# Altium schematic sheet MCU_RF.SchDoc
size B
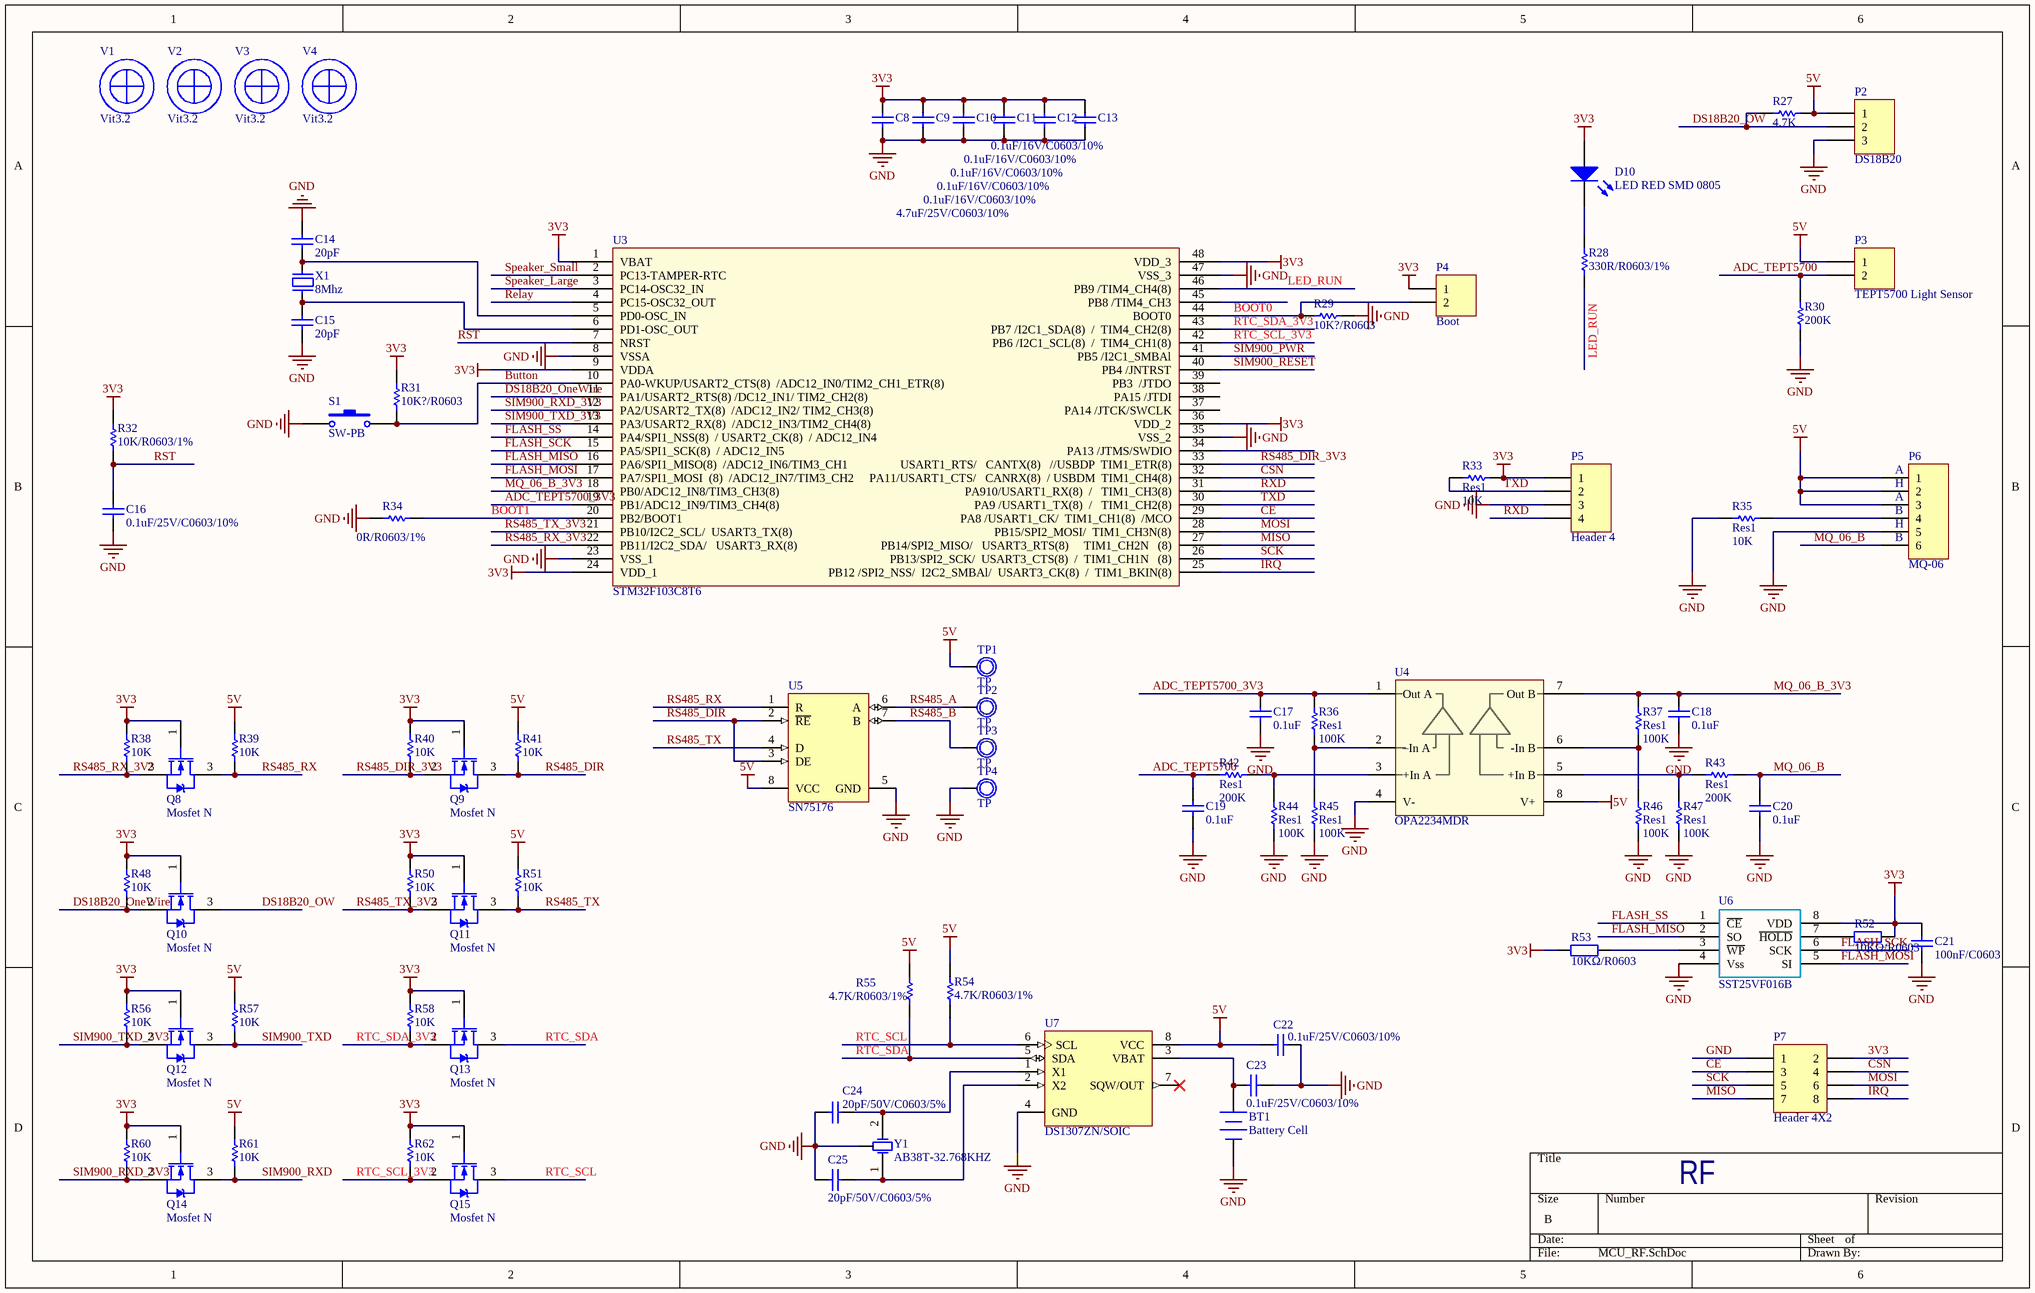
[diagram p0: MCU_RF.SchDoc]

## Parts
BT1  Battery Cell  [Battery CELL_HOLDER]
C8  4.7uF/25V/C0603/10%  [C0603]
C9  0.1uF/16V/C0603/10%  [C0603]
C10  0.1uF/16V/C0603/10%  [C0603]
C11  0.1uF/16V/C0603/10%  [C0603]
C12  0.1uF/16V/C0603/10%  [C0603]
C13  0.1uF/16V/C0603/10%  [C0603]
C14  20pF  [C0603]
C15  20pF  [C0603]
C16  0.1uF/25V/C0603/10%  [C0603]
C17  0.1uF  [C0603]
C18  0.1uF  [C0603]
C19  0.1uF  [C0603]
C20  0.1uF  [C0603]
C21  100nF/C0603  [c0603]
C22  0.1uF/25V/C0603/10%  [C0603]
C23  0.1uF/25V/C0603/10%  [C0603]
C24  20pF/50V/C0603/5%  [C0603]
C25  20pF/50V/C0603/5%  [C0603]
D10  LED RED SMD 0805  [led0805]
P2  DS18B20  [HDR1X3]
P3  TEPT5700 Light Sensor  [LED-5-BLUE]
P4  Boot  [HDR1X2]
P5  Header 4  [HDR1X4]
P6  MQ-06  [MQ-02]
P7  Header 4X2  [HDR2X4]
Q8  Mosfet N  [SOT 23]
Q9  Mosfet N  [SOT 23]
Q10  Mosfet N  [SOT 23]
Q11  Mosfet N  [SOT 23]
Q12  Mosfet N  [SOT 23]
Q13  Mosfet N  [SOT 23]
Q14  Mosfet N  [SOT 23]
Q15  Mosfet N  [SOT 23]
R27  value 4.7K  [SM-RES-0805]  (hidden comment: Res1)
R28  330R/R0603/1%  [R0603]
R29  10K?/R0603  [R0603]
R30  value 200K  [SM-RES-0805]  (hidden comment: Res1)
R31  10K?/R0603  [R0603]
R32  10K/R0603/1%  [R0603]
R33  Res1  value 10K  [R0603]
R34  0R/R0603/1%  [R0603]
R35  Res1  value 10K  [SM-RES-0805]
R36  Res1  value 100K  [R0603]
R37  Res1  value 100K  [R0603]
R38  10K  [R0603]
R39  10K  [R0603]
R40  10K  [R0603]
R41  10K  [R0603]
R42  Res1  value 200K  [R0603]
R43  Res1  value 200K  [R0603]
R44  Res1  value 100K  [R0603]
R45  Res1  value 100K  [R0603]
R46  Res1  value 100K  [R0603]
R47  Res1  value 100K  [R0603]
R48  10K  [R0603]
R50  10K  [R0603]
R51  10K  [R0603]
R52  10KΩ/R0603  [r0603]
R53  10KΩ/R0603  [r0603]
R54  4.7K/R0603/1%  [R0603]
R55  4.7K/R0603/1%  [R0603]
R56  10K  [R0603]
R57  10K  [R0603]
R58  10K  [R0603]
R60  10K  [R0603]
R61  10K  [R0603]
R62  10K  [R0603]
S1  SW-PB  [Button-2pin]
TP1  TP  [TP1]
TP2  TP  [TP1]
TP3  TP  [TP1]
TP4  TP  [TP1]
U3  STM32F103C8T6  [ST_TSQFP50P910X910X160-48N]
U4  OPA2234MDR  [SOP 8Pin]
U5  SN75176  [SOP127P600X175-8N]
U6  SST25VF016B  [SOIC8]
U7  DS1307ZN/SOIC  [SOIC-8]
V1  Vit3.2  [Vit3.2]
V2  Vit3.2  [Vit3.2]
V3  Vit3.2  [Vit3.2]
V4  Vit3.2  [Vit3.2]
X1  8Mhz  [XT2]
Y1  AB38T-32.768KHZ  [ZTA - 38k]

## Nets
3V3: C8.2 C9.2 C10.2 C11.2 C12.2 C13.2 C21.2 D10.1(A) P4.1 P5.1 P7.2 Q8.1(G) Q9.1(G) Q10.1(G) Q11.1(G) Q12.1(G) Q13.1(G) Q14.1(G) Q15.1(G) R31.1 R32.2 R33.2 R38.1 R40.1 R48.1 R50.1 R52.2 R53.1 R56.1 R58.1 R60.1 R62.1 U3.1(VBAT) U3.9(VDDA) U3.24(VDD_1) U3.36(VDD_2) U3.48(VDD_3) U6.8(VDD)
5V: C22.2 P2.1 P3.1 P6.1 P6.2 P6.3 R27.1 R39.1 R41.1 R51.1 R54.2 R55.2 R57.1 R61.1 TP1.1 U4.8(V+) U5.8(VCC) U7.8(VCC)
GND: BT1.2(-) C8.1 C9.1 C10.1 C11.1 C12.1 C13.1 C14.2 C15.1 C16.1 C17.2 C18.2 C19.2 C20.2 C21.1 C22.1 C23.1 C24.1 C25.1 P2.3 P5.3 P6.5 P7.1 R29.1 R30.1 R34.1 R35.1 R44.1 R45.1 R46.1 R47.1 S1.1 TP4.1 U3.8(VSSA) U3.23(VSS_1) U3.35(VSS_2) U3.47(VSS_3) U4.4(V-) U5.5(GND) U6.4(Vss) U7.4(GND) Y1.3(GND)
ADC_TEPT5700: C19.1 P3.2 R30.2 R42.1
ADC_TEPT5700_3V3: C17.1 R36.2 U3.19(PB1/ADC12_IN9/TIM3_CH4(8)) U4.1(Out_A)
BOOT0: P4.2 R29.2 U3.44(BOOT0)
BOOT1: R34.2 U3.20(PB2/BOOT1)
Button: R31.2 S1.2 U3.10(PA0-WKUP/USART2_CTS(8)__/ADC12_IN0/TIM2_CH1_ETR(8))
CE: P7.3 U3.29(PA8_/USART1_CK/__TIM1_CH1(8)__/MCO)
CSN: P7.4 U3.32(PA11/USART1_CTS/___CANRX(8)__/_USBDM__TIM1_CH4(8))
DS18B20_OneWire: Q10.2(S) R48.2 U3.11(PA1/USART2_RTS(8)_/DC12_IN1/_TIM2_CH2(8))
DS18B20_OW: P2.2 Q10.3(D) R27.2
FLASH_MISO: U3.16(PA6/SPI1_MISO(8)__/ADC12_IN6/TIM3_CH1) U6.2(SO)
FLASH_MOSI: U3.17(PA7/SPI1_MOSI__(8)__/ADC12_IN7/TIM3_CH2) U6.5(SI)
FLASH_SCK: U3.15(PA5/SPI1_SCK(8)__/_ADC12_IN5) U6.6(SCK)
FLASH_SS: U3.14(PA4/SPI1_NSS(8)__/_USART2_CK(8)__/_ADC12_IN4) U6.1(~{CE})
IRQ: P7.8 U3.25(PB12_/SPI2_NSS/__I2C2_SMBAl/__USART3_CK(8)__/__TIM1_BKIN(8))
LED_RUN: R28.2 U3.46(PB9_/TIM4_CH4(8))
MISO: P7.7 U3.27(PB14/SPI2_MISO/___USART3_RTS(8)_____TIM1_CH2N___(8))
MOSI: P7.6 U3.28(PB15/SPI2_MOSI/__TIM1_CH3N(8))
MQ_06_B: C20.1 P6.6 R43.2
MQ_06_B_3V3: C18.1 R37.2 U3.18(PB0/ADC12_IN8/TIM3_CH3(8)) U4.7(Out_B)
Relay: U3.4(PC15-OSC32_OUT)
RS485_A: TP2.1 U5.6(A)
RS485_B: TP3.1 U5.7(B)
RS485_DIR: Q9.3(D) R41.2 U5.2(~{RE}) U5.3(DE)
RS485_DIR_3V3: Q9.2(S) R40.2 U3.33(USART1_RTS/___CANTX(8)___//USBDP__TIM1_ETR(8))
RS485_RX: Q8.3(D) R39.2 U5.1(R)
RS485_RX_3V3: Q8.2(S) R38.2 U3.22(PB11/I2C2_SDA/___USART3_RX(8))
RS485_TX: Q11.3(D) R51.2 U5.4(D)
RS485_TX_3V3: Q11.2(S) R50.2 U3.21(PB10/I2C2_SCL/__USART3_TX(8))
RST: C16.2 R32.1 U3.7(NRST)
RTC_SCL: Q15.3(D) R54.1 U7.6(SCL)
RTC_SCL_3V3: Q15.2(S) R62.2 U3.42(PB6_/I2C1_SCL(8)__/__TIM4_CH1(8))
RTC_SDA: Q13.3(D) R55.1 U7.5(SDA)
RTC_SDA_3V3: Q13.2(S) R58.2 U3.43(PB7_/I2C1_SDA(8)__/__TIM4_CH2(8))
RXD: P5.4 U3.31(PA910/USART1_RX(8)__/___TIM1_CH3(8))
SCK: P7.5 U3.26(PB13/SPI2_SCK/__USART3_CTS(8)__/__TIM1_CH1N___(8))
SIM900_PWR: U3.41(PB5_/I2C1_SMBAl)
SIM900_RESET: U3.40(PB4_/JNTRST)
SIM900_RXD: Q14.3(D) R61.2
SIM900_RXD_3V3: Q14.2(S) R60.2 U3.12(PA2/USART2_TX(8)__/ADC12_IN2/_TIM2_CH3(8))
SIM900_TXD: Q12.3(D) R57.2
SIM900_TXD_3V3: Q12.2(S) R56.2 U3.13(PA3/USART2_RX(8)__/ADC12_IN3/TIM2_CH4(8))
Speaker_Large: U3.3(PC14-OSC32_IN)
Speaker_Small: U3.2(PC13-TAMPER-RTC)
TXD: P5.2 R33.1 U3.30(PA9_/USART1_TX(8)__/___TIM1_CH2(8))
NetBT1_1: BT1.1(+) C23.2 U7.3(VBAT)
NetC14_1: C14.1 U3.5(PD0-OSC_IN) X1.2
NetC15_2: C15.2 U3.6(PD1-OSC_OUT) X1.1
NetC24_2: C24.2 U7.1(X1) Y1.2(OSC2)
NetC25_2: C25.2 U7.2(X2) Y1.1(OSC1)
NetD10_2: D10.2(K) R28.1
NetP6_4: P6.4 R35.2
NetR36_1: R36.1 R45.2 U4.2(–In_A)
NetR37_1: R37.1 R46.2 U4.6(-In_B)
NetR42_2: R42.2 R44.2 U4.3(+In_A)
NetR43_1: R43.1 R47.2 U4.5(+In_B)
NetR52_1: R52.1 U6.7(~{HOLD})
NetR53_2: R53.2 U6.3(~{WP})

Not connected (* = marked no-connect by the designer): U3 34(PA13_/JTMS/SWDIO) 37(PA14_/JTCK/SWCLK) 38(PA15_/JTDI) 39(PB3__/JTDO) 45(PB8_/TIM4_CH3); U7 7(SQW/OUT)*

## Notes on the sheet
- (near P6) A
- (near P6) H
- (near P6) B
- RF

## Library data of the parts
BT1 = Battery Holder Cell 20mm: HOLDER COINCELL 2032 RETAINRCLIP; Manufacturer: MPD (Memory Protection Devices); Manufacturer Part Number: BS-7; Battery Type, Function: Coin Cell, Holder; Style: Holder (Open); Battery Cell Size: Coin, 20.0mm; Number of Cells: 1; Battery Series: 2032; Supplier 1: Digi-Key; RoHS: RoHS Compliant; Category: Battery Products; Stock 1: 37883; Pricing 1: 1=0.77, 10=0.71, 100=0.64, 500=0.58, 1000=0.46 (USD); Mounting Type: PCB, Through Hole; Termination Style: PC Pin; Height Above Board: 0.354" (9.00mm); Operating Temperature: -55°C ~ 105°C; ComponentLink1URL: http://www.memoryprotectiondevices.com/datasheets/BS-7-datasheet.pdf; ComponentLink1Description: http://www.memoryprotectiondevices.com/datasheets/BS-7-datasheet.pdf; Supplier Part Number 1: BS-7-ND
C8 = 4.7uF/25V/C0603/10%: CAP CER 4.7UF 25V 10% X6S 0603; Manufacturer: Murata Electronics North America; Manufacturer Part Number: GRM188C81E475KE11D; Capacitance: 4.7µF; Supplier 1: Digi-Key; RoHS: RoHS Compliant; Category: Capacitors; Stock 1: 57548; Pricing 1: 1=0.42, 10=0.368, 50=0.2236, 100=0.1841, 250=0.14728, 500=0.13414, 1000=0.12098 (USD); Packaging: Digi-Reel®; Tolerance: ±10%; Voltage - Rated: 25V; Temperature Coefficient: X6S; Mounting Type: Surface Mount, MLCC; Operating Temperature: -55°C ~ 105°C; Applications: General Purpose; Ratings: -; Package / Case: 0603 (1608 Metric); Size / Dimension: 0.063" L x 0.031" W (1.60mm x 0.80mm); Height - Seated (Max): -; Thickness (Max): 0.039" (1.00mm); Lead Spacing: -; Features: -; Lead Style: -; ComponentLink1URL: http://www.murata.com/~/media/webrenewal/support/library/catalog/products/capacitor/mlcc/c02e.ashx; ComponentLink1Description: http://www.murata.com/~/media/webrenewal/support/library/catalog/products/capacitor/mlcc/c02e.ashx
C9-C13 = 0.1uF/16V/C0603/10%: CAP CER 0.1UF 16V 10% X7R 0603; Manufacturer: Kemet; Manufacturer Part Number: C0603C104K4RACTU; Capacitance: 0.1µF; Supplier 1: Digi-Key; RoHS: RoHS Compliant; Category: Capacitors; Stock 1: 2315544; Pricing 1: 1=0.1, 10=0.022, 25=0.0156, 50=0.012, 100=0.0101, 250=0.00828, 1000=0.0054 (USD); Packaging: Cut Tape (CT); Tolerance: ±10%; Voltage - Rated: 16V; Temperature Coefficient: X7R; Mounting Type: Surface Mount, MLCC; Operating Temperature: -55°C ~ 125°C; Applications: General Purpose; Ratings: -; Package / Case: 0603 (1608 Metric); Size / Dimension: 0.063" L x 0.031" W (1.60mm x 0.80mm); Height - Seated (Max): -; Thickness (Max): 0.034" (0.87mm); Lead Spacing: -; Features: -; Lead Style: -; ComponentLink1URL: http://www.kemet.com/docfinder?Partnumber=C0603C104K4RACTU; ComponentLink1Description: http://www.kemet.com/docfinder?Partnumber=C0603C104K4RACTU; Supplier Part Number 1: 399-1096-1-ND
C14 C15 = Cap: Capacitor; Ordering: 10pF/C0603/6.3V; Muf: Murata/Japan; Des: Ceramic Cap; Property: Cap; Price: *
C16-C20 C22 C23 = 0.1uF/25V/C0603/10%: CAP CER 0.1UF 25V 10% X7R 0603; Manufacturer: Murata Electronics North America; Manufacturer Part Number: GRM188R71E104KA01D; Capacitance: 0.1µF; Supplier 1: Digi-Key; RoHS: RoHS Compliant; Category: Capacitors; Stock 1: 8148157; Pricing 1: 1=0.1, 10=0.019, 50=0.0104, 100=0.0088, 250=0.0072, 500=0.00616, 1000=0.0048 (USD); Packaging: Cut Tape (CT); Tolerance: ±10%; Voltage - Rated: 25V; Temperature Coefficient: X7R; Mounting Type: Surface Mount, MLCC; Operating Temperature: -55°C ~ 125°C; Applications: General Purpose; Ratings: -; Package / Case: 0603 (1608 Metric); Size / Dimension: 0.063" L x 0.031" W (1.60mm x 0.80mm); Height - Seated (Max): -; Thickness (Max): 0.035" (0.90mm); Lead Spacing: -; Features: -; Lead Style: -; ComponentLink1URL: http://www.murata.com/~/media/webrenewal/support/library/catalog/products/capacitor/mlcc/c02e.ashx; ComponentLink1Description: http://www.murata.com/~/media/webrenewal/support/library/catalog/products/capacitor/mlcc/c02e.ashx
C21 = Cap: Capacitor; Published: 8-Jun-2000; LatestRevisionDate: 17-Jul-2002; LatestRevisionNote: Re-released for DXP Platform.; PackageReference: RAD-0.3; Publisher: Altium Limited; Value: 100nF/C0603
C24 C25 = 20pF/50V/C0603/5%: CAP CER 20PF 50V 5% NP0 0603; Manufacturer: Samsung Electro-Mechanics America, Inc.; Manufacturer Part Number: CL10C200JB8NNNC; Temperature Coefficient: C0G, NP0; Supplier 1: Digi-Key; RoHS: RoHS Compliant; Category: Capacitors; Stock 1: 129313; Pricing 1: 1=0.1, 10=0.031, 25=0.0216, 100=0.0141, 500=0.00986, 1000=0.00768 (USD); Packaging: Cut Tape (CT); Capacitance: 20pF; Tolerance: ±5%; Voltage - Rated: 50V; Mounting Type: Surface Mount, MLCC; Operating Temperature: -55°C ~ 125°C; Applications: General Purpose; Ratings: -; Package / Case: 0603 (1608 Metric); Size / Dimension: 0.063" L x 0.031" W (1.60mm x 0.80mm); Height - Seated (Max): -; Thickness (Max): 0.035" (0.90mm); Lead Spacing: -; Features: -; Lead Style: -; ComponentLink1URL: http://www.samsungsem.com/kr/support/product-search/mlcc/CL10C200JB8NNNC.jsp; ComponentLink1Description: http://www.samsungsem.com/kr/support/product-search/mlcc/CL10C200JB8NNNC.jsp
D10 = LED RED SMD 0805: LED RED DIFFUSED 0805 SMD; Manufacturer: OSRAM Opto Semiconductors Inc.; Manufacturer Part Number: LH R974-LP-1; Wavelength - Dominant: 645nm; Wavelength - Peak: 660nm; Millicandela Rating: 41mcd; Voltage - Forward (Vf) (Typ): 1.8V; Current - Test: 20mA; Viewing Angle: 160°; Lens Color: White; Lens Style/Size: Rectangle with Flat Top, 1.30mm x 1.25mm; Supplier 1: Digi-Key; RoHS: RoHS Compliant; Category: Optoelectronics; Stock 1: 72062; Pricing 1: 1=0.26, 10=0.207, 25=0.1792, 100=0.1131, 250=0.0754, 500=0.06408, 1000=0.049 (USD); Packaging: Cut Tape (CT); Color: Red; Lens Transparency: Diffused; Package / Case: 0805 (2012 Metric); Supplier Device Package: *; Size / Dimension: 2.00mm L x 1.25mm W; Height (Max): 0.90mm; Mounting Type: Surface Mount; ComponentLink1URL: http://www.osram-os.com/Graphics/XPic8/00078869_0.pdf; ComponentLink1Description: http://www.osram-os.com/Graphics/XPic8/00078869_0.pdf
P2 = Header 3: Header, 3-Pin; LatestRevisionDate: 17-Jul-2002; LatestRevisionNote: Re-released for DXP Platform.; Publisher: Altium Limited
P3 P4 = Header 2: Header, 2-Pin; LatestRevisionDate: 17-Jul-2002; LatestRevisionNote: Re-released for DXP Platform.; Publisher: Altium Limited
P5 = Header 4: Header, 4-Pin; LatestRevisionDate: 17-Jul-2002; LatestRevisionNote: Re-released for DXP Platform.; Publisher: Altium Limited
P6 = Header 6: Header, 6-Pin; LatestRevisionDate: 17-Jul-2002; LatestRevisionNote: Re-released for DXP Platform.; Publisher: Altium Limited
P7 = Header 4X2: Header, 4-Pin, Dual row; LatestRevisionDate: 17-Jul-2002; LatestRevisionNote: Re-released for DXP Platform.; Publisher: Altium Limited
R27 R30 R33 R35-R37 R42-R47 = Res1: Resistor; Published: 8-Jun-2000; LatestRevisionDate: 17-Jul-2002; LatestRevisionNote: Re-released for DXP Platform.; PackageReference: AXIAL-0.3; Publisher: Altium Limited; PackageDescription: Axial Device, Thru-Hole; 2 Leads; 0.3 in Pin Spacing
R28 = 330R/R0603/1%: RES SMD 330 OHM 1% 1/10W 0603; Manufacturer: Yageo; Manufacturer Part Number: RC0603FR-07330RL; Resistance (Ohms): 330; Power (Watts): 0.1W, 1/10W; Temperature Coefficient: ±100ppm/°C; Supplier 1: Digi-Key; RoHS: RoHS Compliant; Category: Resistors; Stock 1: 464448; Pricing 1: 1=0.1, 10=0.014, 25=0.01, 100=0.0057, 250=0.00436, 500=0.00348, 1000=0.00257, 2500=0.00223 (USD); Packaging: Cut Tape (CT); Tolerance: ±1%; Composition: Thick Film; Features: Moisture Resistant; Operating Temperature: -55°C ~ 155°C; Package / Case: 0603 (1608 Metric); Supplier Device Package: 0603; Size / Dimension: 0.063" L x 0.031" W (1.60mm x 0.80mm); Height: 0.022" (0.55mm); Number of Terminations: 2; ComponentLink1URL: http://www.yageo.com/NewPortal/yageodocoutput?fileName=/pdf/R-Chip/PYu-RC_Group_51_RoHS_L_3.pdf; ComponentLink1Description: http://www.yageo.com/NewPortal/yageodocoutput?fileName=/pdf/R-Chip/PYu-RC_Group_51_RoHS_L_3.pdf
R29 R31 = Res1: Resistor; Muf: Vishay/USA; Property: Res; Ordering: 10K?/R0603; Des: *
R32 = 10M/R0603/1%: RES SMD 10M OHM 1% 1/10W 0603; Manufacturer: Yageo; Manufacturer Part Number: RC0603FR-0710ML; Power (Watts): 0.1W, 1/10W; Temperature Coefficient: ±100ppm/°C; Supplier 1: Digi-Key; RoHS: RoHS Compliant; Category: Resistors; Stock 1: 620000; Pricing 1: 5000=0.00175, 10000=0.00152, 25000=0.00133, 50000=0.00122, 125000=0.0012 (USD); Packaging: Tape & Reel (TR); Resistance (Ohms): 10M; Tolerance: ±1%; Composition: Thick Film; Features: Moisture Resistant; Operating Temperature: -55°C ~ 155°C; Package / Case: 0603 (1608 Metric); Supplier Device Package: 0603; Size / Dimension: 0.063" L x 0.031" W (1.60mm x 0.80mm); Height: 0.022" (0.55mm); Number of Terminations: 2; ComponentLink1URL: http://www.yageo.com/NewPortal/yageodocoutput?fileName=/pdf/R-Chip/PYu-RC_Group_51_RoHS_L_3.pdf; ComponentLink1Description: http://www.yageo.com/NewPortal/yageodocoutput?fileName=/pdf/R-Chip/PYu-RC_Group_51_RoHS_L_3.pdf; Supplier Part Number 1: 311-10.0MHRTR-ND
R34 = 0R/R0603/1%: RES SMD 0.01 OHM 1% 1/10W 0603; Manufacturer: Yageo; Manufacturer Part Number: RL0603FR-070R01L; Resistance (Ohms): 0.01; Power (Watts): 0.1W, 1/10W; Temperature Coefficient: ±1500ppm/°C; Supplier 1: Digi-Key; RoHS: RoHS Compliant; Category: Resistors; Stock 1: 30355; Pricing 1: 1=0.76, 10=0.546, 25=0.426, 100=0.2839, 250=0.24024, 500=0.19656, 1000=0.15288, 2500=0.14742 (USD); Packaging: Cut Tape (CT); Tolerance: ±1%; Composition: Thick Film; Features: Current Sense, Moisture Resistant; Operating Temperature: -55°C ~ 155°C; Package / Case: 0603 (1608 Metric); Supplier Device Package: 0603; Size / Dimension: 0.063" L x 0.031" W (1.60mm x 0.80mm); Height: 0.022" (0.55mm); Number of Terminations: 2; ComponentLink1URL: http://www.yageo.com/documents/recent/PYu-RL_Group_521_RoHS_L_1.pdf; ComponentLink1Description: http://www.yageo.com/documents/recent/PYu-RL_Group_521_RoHS_L_1.pdf; Supplier Part Number 1: 311-.01QCT-ND
R38-R41 R48 R50 R51 R54-R58 R60-R62 = 4.7K/R0603/1%: RES SMD 4.7K OHM 1% 1/10W 0603; Manufacturer: Yageo; Manufacturer Part Number: RC0603FR-074K7L; Power (Watts): 0.1W, 1/10W; Temperature Coefficient: ±100ppm/°C; Supplier 1: Digi-Key; RoHS: RoHS Compliant; Category: Resistors; Stock 1: 3295420; Pricing 1: 1=0.1, 10=0.014, 25=0.01, 100=0.0057, 250=0.00436, 500=0.00348, 1000=0.00257, 2500=0.00223 (USD); Packaging: Cut Tape (CT); Resistance (Ohms): 4.7k; Tolerance: ±1%; Composition: Thick Film; Features: Moisture Resistant; Operating Temperature: -55°C ~ 155°C; Package / Case: 0603 (1608 Metric); Supplier Device Package: 0603; Size / Dimension: 0.063" L x 0.031" W (1.60mm x 0.80mm); Height: 0.022" (0.55mm); Number of Terminations: 2; ComponentLink1URL: http://www.yageo.com/NewPortal/yageodocoutput?fileName=/pdf/R-Chip/PYu-RC_Group_51_RoHS_L_3.pdf; ComponentLink1Description: http://www.yageo.com/NewPortal/yageodocoutput?fileName=/pdf/R-Chip/PYu-RC_Group_51_RoHS_L_3.pdf; Supplier Part Number 1: 311-4.70KHRCT-ND
R52 R53 = Res2: Resistor; Ordering: 10KΩ/R0603; Muf: *; Property: Resistor; Des: *; Price: *
S1 = SW-PB: Switch; Published: 24-Mar-1999; LatestRevisionDate: 17-Jul-2002; LatestRevisionNote: Re-released for DXP Platform.; PackageReference: SPST-2; Publisher: Altium Limited
TP1-TP4 = TP1: Test Point; Value: Test Point
U3 = STM32F103C8T6: Medium-density performance line ARM-based 32-bit MCU with 64 or  128 KB Flash, USB, CAN, 7 timers, 2 ADCs, 9 communication interfaces
U4 = OPA2234M: LOW-POWER, PRECISION  SINGLE-SUPPLY OPERATIONAL AMPLIFIERS; Muf: TI/USA; Property: IC; Des: LOW-POWER, PRECISION  SINGLE-SUPPLY OPERATIONAL AMPLIFIERS; Ordering: OPA2234MDR; Price: 5RMB
U5 = SN75176_RS485: RS485 Interface
U7 = DS1307ZN+T&R: IC RTC CLK/CALENDAR I2C 8-SOIC; Manufacturer: Maxim Integrated; Memory Size: 56B; Time Format: HH:MM:SS (12/24 hr); Date Format: YY-MM-DD-dd; Interface: I²C, 2-Wire Serial; Voltage - Supply: 4.5 V ~ 5.5 V; Voltage - Supply, Battery: 2 V ~ 3.5 V; Current - Timekeeping (Max): 200µA @ 5V; Supplier 1: Digi-Key; Manufacturer Part Number: DS1307ZN+T&R; RoHS: RoHS Compliant; Category: Integrated Circuits (ICs); Stock 1: 12500; Pricing 1: 2500=1.62792 (USD); Packaging: Tape & Reel (TR); Type: Clock/Calendar; Features: Leap Year, NVSRAM, Square Wave Output; Operating Temperature: -40°C ~ 85°C; Mounting Type: Surface Mount; Package / Case: 8-SOIC (0.154", 3.90mm Width); Supplier Device Package: 8-SOIC N; ComponentLink1URL: http://datasheets.maximintegrated.com/en/ds/DS1307.pdf; ComponentLink1Description: http://datasheets.maximintegrated.com/en/ds/DS1307.pdf
X1 = XT2: Crystal For all Crystal 2pin.; Value: 4Mhz
Y1 = AB38T-32.768KHZ: CRYSTAL 32.7680KHZ 12.5PF T/H; Manufacturer: Abracon LLC; Frequency Tolerance: ±20ppm; ESR (Equivalent Series Resistance): 30 kOhm; Operating Mode: Fundamental; Supplier 1: Digi-Key; Manufacturer Part Number: AB38T-32.768KHZ; RoHS: RoHS Compliant; Category: Crystals and Oscillators; Stock 1: 38720; Pricing 1: 1=0.17, 10=0.145, 50=0.1306, 100=0.116, 500=0.1102, 1000=0.0928, 2500=0.087, 5000=0.0841, 10000=0.0812 (USD); Packaging: Bulk; Type: kHz Crystal (Tuning Fork); Frequency: 32.768kHz; Frequency Stability: -; Load Capacitance: 12.5pF; Operating Temperature: -10°C ~ 60°C; Ratings: -; Mounting Type: Through Hole; Package / Case: Cylindrical Can, Radial; Size / Dimension: 0.126" Dia x 0.330" L (3.20mm x 8.30mm); Height: 0.327" (8.30mm); ComponentLink1URL: http://www.abracon.com/Resonators/AB38T.pdf; ComponentLink1Description: http://www.abracon.com/Resonators/AB38T.pdf